# Altium schematic sheet Sensor.SchDoc
size A
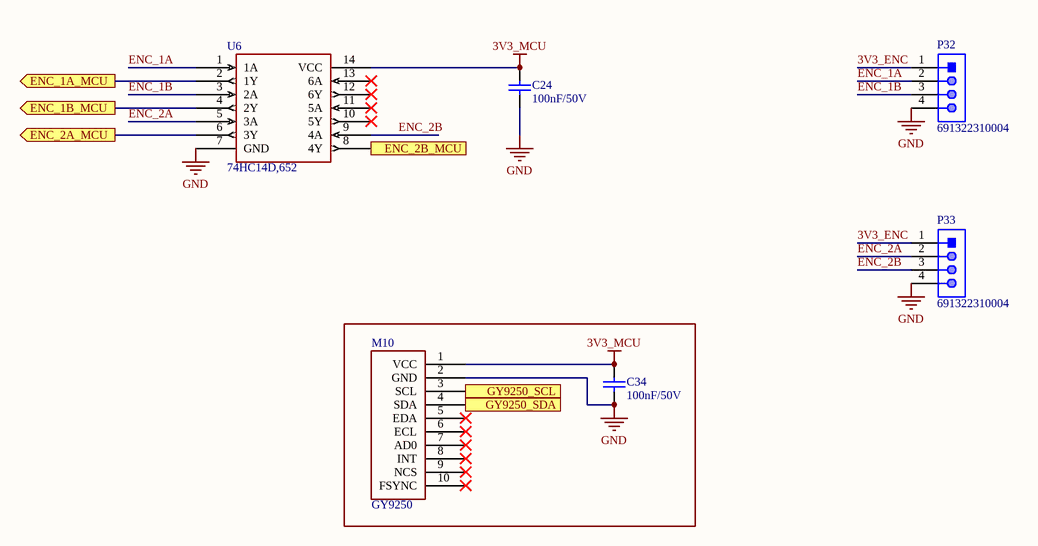
[diagram p0: Sensor.SchDoc]

## Parts
C24  value 100nF/50V  [CAP-SM-0805]  (hidden comment: Cap-100nF-50V-0805)
C34  value 100nF/50V  [CAP-SM-0805]  (hidden comment: Cap-100nF-50V-0805)
M10  GY9250  [GY9250]
P32  691322310004  [691322310004]
P33  691322310004  [691322310004]
U6  74HC14D,652  [SOT108-1_NEX]

## Ports
ENC_1A_MCU (out), ENC_1B_MCU (out), ENC_2A_MCU (out), ENC_2B_MCU (out), GY9250_SCL (in), GY9250_SDA (in)

## Nets
3V3_MCU: C24.2 C34.2 M10.1(VCC) U6.14(VCC)
GND: C24.1 C34.1 M10.2(GND) P32.4 P33.4 U6.7(GND)
3V3_ENC: P32.1 P33.1
ENC_1A: P32.2 U6.1(1A)
ENC_1A_MCU: U6.2(1Y) ; port ENC_1A_MCU
ENC_1B: P32.3 U6.3(2A)
ENC_1B_MCU: U6.4(2Y) ; port ENC_1B_MCU
ENC_2A: P33.2 U6.5(3A)
ENC_2A_MCU: U6.6(3Y) ; port ENC_2A_MCU
ENC_2B: P33.3 U6.9(4A)
ENC_2B_MCU: U6.8(4Y) ; port ENC_2B_MCU
GY9250_SCL: M10.3(SCL) ; port GY9250_SCL
GY9250_SDA: M10.4(SDA) ; port GY9250_SDA

Not connected (* = marked no-connect by the designer): M10 5(EDA)* 6(ECL)* 7(AD0)* 8(INT)* 9(NCS)* 10(FSYNC)*; U6 10(5Y)* 11(5A)* 12(6Y)* 13(6A)*

## Library data of the parts
C24 C34 = Cap-100nF-50V-0805: CAP CER 0.1UF 50V Y5V 0805; Manufacturer: Samsung Electro-Mechanics; Manufacturer Part Number: CL21F104ZBCNNNC; Local Supplier: thegioiic; Local Supplier Link: https://thegioiic.com/products/tu-100nf-0-1uf-50v-0805; Supplier 1: Digikey; Supplier 1 Part Number: 1276-1007-1-ND; Supplier 1 Link: https://www.digikey.com/product-detail/en/samsung-electro-mechanics/CL21F104ZBCNNNC/1276-1007-1-ND/3889093
P32 P33 = 691322310004: WR-TBL Serie 322 Horizontal PCB Header, Pluggable, pitch 3.81mm, 4p; Compliance: RoHS; Modularity: No; Pin Number: 4; Rated Current [UL]: 10A; Working Voltage [UL]: 300VAC; ComponentLink1Description: Manufacturer; ComponentLink1URL: http://www.we-online.de; ComponentLink2URL: https://katalog.we-online.de/em/datasheet/691322310004.pdf; ComponentLink2Description: Datasheet; Mounting Technology: THT; Part Number: 691322310004; Packaging: Box; Operating Temperature: -40 to +105degC; PCB/Cable/Panel: PCB; Pitch: 3.81mm; Published Date: October 2019; Type: Horizontal; Publisher: Wurth Elektronik; Application: Pluggable
M10 = GY9250: Local Supplier: HShop; Local Supplier Link: *; Local Supplier Part Number: *; Manufacturer: *; Manufacturer Part Number: *